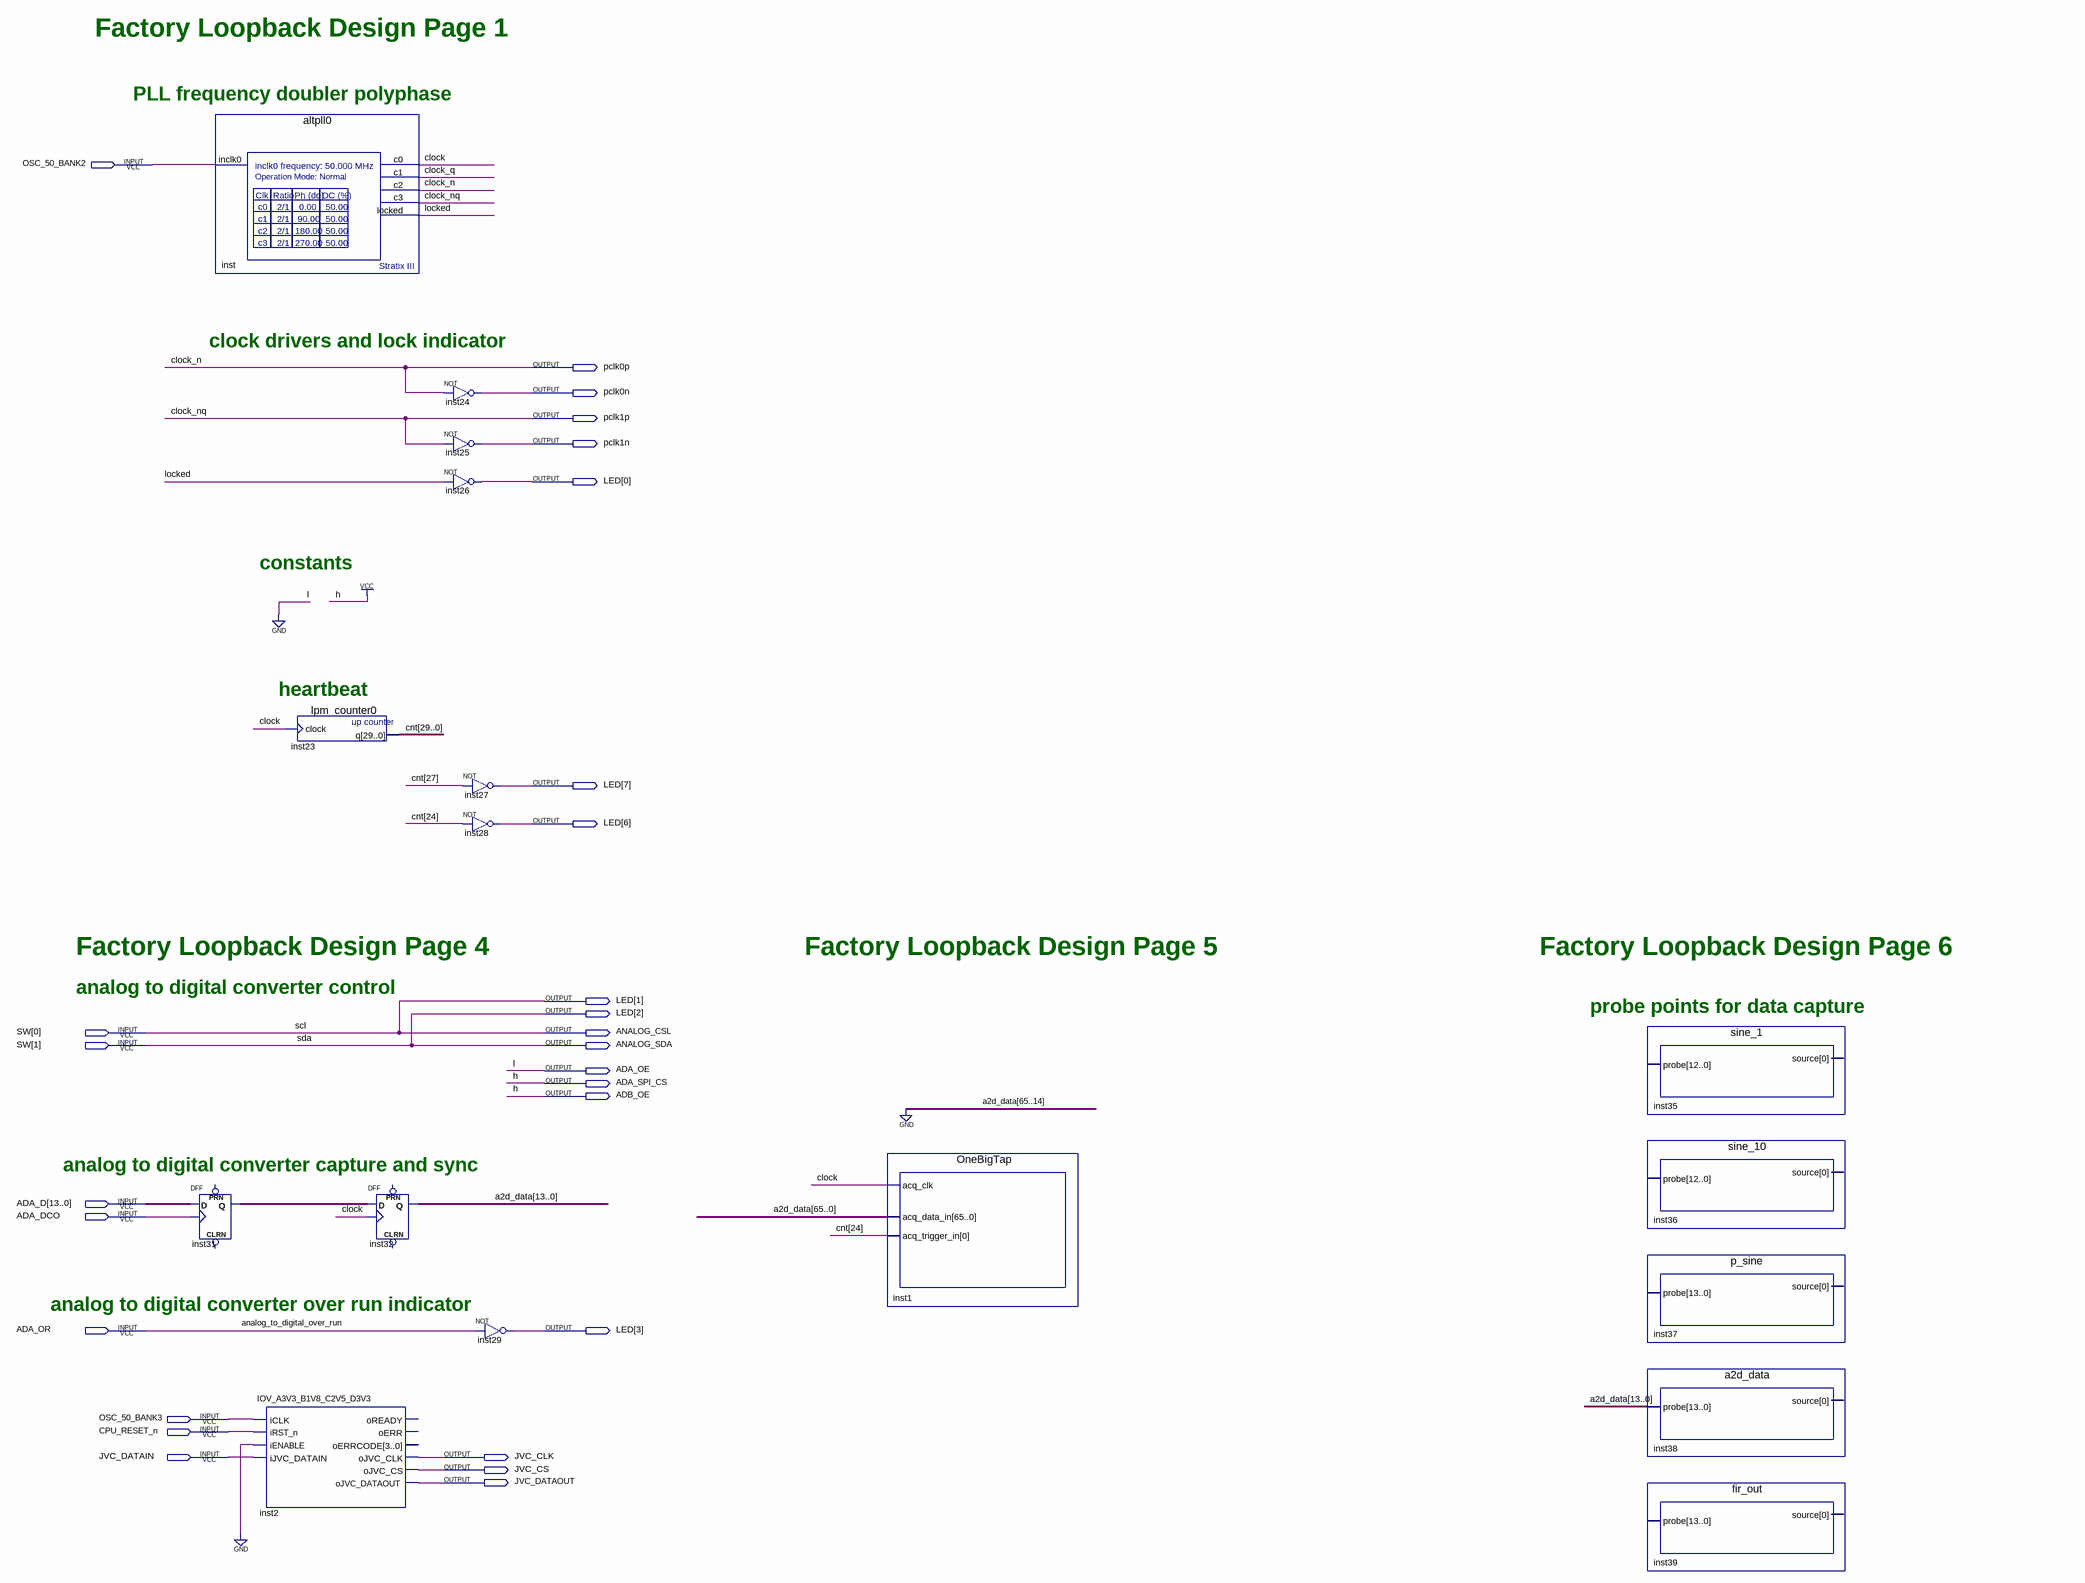
[diagram p0: schematic sheet]
// Quartus schematic DE3_dsp_design_top.bdf as structural Verilog: 17 symbols, 27 pins
module DE3_dsp_design_top (
  input  OSC_50_BANK2,
  input  [1:0] SW,
  input  [13:0] ADA_D,
  input  ADA_DCO,
  input  ADA_OR,
  input  OSC_50_BANK3,
  input  CPU_RESET_n,
  input  JVC_DATAIN,
  output pclk0p,
  output pclk0n,
  output pclk1p,
  output pclk1n,
  output [7:0] LED,
  output ANALOG_CSL,
  output ANALOG_SDA,
  output ADA_OE,
  output ADA_SPI_CS,
  output ADB_OE,
  output JVC_CLK,
  output JVC_CS,
  output JVC_DATAOUT
);

  wire clock, clock_q, locked;
  wire [13:0] a2d_data, inst31_q;
  wire [29:0] cnt;

  altpll0 inst (.inclk0(OSC_50_BANK2), .c0(clock), .c1(clock_q), .c2(pclk0p), .c3(pclk1p), .locked(locked));
  DFF inst31[13:0] (.CLK(ADA_DCO), .D(ADA_D), .Q(inst31_q));  // open: CLRN, PRN
  IOV_A3V3_B1V8_C2V5_D3V3 inst2 (
    .iCLK(OSC_50_BANK3), .iRST_n(CPU_RESET_n), .iENABLE(1'b0), .iJVC_DATAIN(JVC_DATAIN), .oJVC_CLK(JVC_CLK),
    .oJVC_CS(JVC_CS), .oJVC_DATAOUT(JVC_DATAOUT));  // open: oREADY, oERR, oERRCODE
  lpm_counter0 inst23 (.clock(clock), .q(cnt));
  DFF inst32[13:0] (.CLK(clock), .D(inst31_q), .Q(a2d_data));  // open: CLRN, PRN
  not inst24 (pclk0n, pclk0p);
  not inst25 (pclk1n, pclk1p);
  not inst26 (LED[0], locked);
  not inst27 (LED[7], cnt[27]);
  not inst28 (LED[6], cnt[24]);
  not inst29 (LED[3], ADA_OR);
  OneBigTap inst1 (.acq_clk(clock), .acq_data_in({{52{1'b0}}, a2d_data}), .acq_trigger_in(cnt[24]));
  sine_1 inst35 ();  // open: probe, source
  sine_10 inst36 ();  // open: probe, source
  p_sine inst37 ();  // open: probe, source
  a2d_data inst38 (.probe(a2d_data));  // open: source
  fir_out inst39 ();  // open: probe, source

  assign ADA_OE = 1'b0;
  assign ADA_SPI_CS = 1'b1;
  assign ADB_OE = 1'b1;
  assign ANALOG_CSL = SW[0];
  assign ANALOG_SDA = SW[1];
  assign LED[2:1] = SW;

  // Other names for the same wires on the sheet: analog_to_digital_over_run = ADA_OR; clock_n = pclk0p;
  //   clock_nq = pclk1p; scl = SW[0]; sda = SW[1]

  // Notes on the sheet:
  //   Factory Loopback Design Page 1
  //   PLL frequency doubler polyphase
  //   clock drivers and lock indicator
  //   constants
  //   heartbeat
  //   Factory Loopback Design Page 4
  //   Factory Loopback Design Page 5
  //   Factory Loopback Design Page 6
  //   analog to digital converter control
  //   probe points for data capture
  //   analog to digital converter capture and sync
  //   analog to digital converter over run indicator
endmodule
